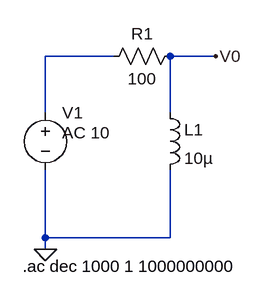
[diagram p0: schematic 1-krets-c.asc]
1-krets-c.asc, the LTspice schematic file:
Version 4
SHEET 1 880 680
WIRE 64 48 -32 48
WIRE 208 48 144 48
WIRE -32 128 -32 48
WIRE 144 128 144 48
WIRE -32 304 -32 208
WIRE 144 304 144 208
WIRE 144 304 -32 304
WIRE -32 320 -32 304
FLAG -32 320 0
FLAG 208 48 V0
SYMBOL voltage -32 112 R0
WINDOW 123 24 44 Left 0
WINDOW 39 0 0 Left 0
SYMATTR Value2 AC 10
SYMATTR InstName V1
SYMATTR Value ""
SYMBOL res 160 32 R90
WINDOW 0 0 56 VBottom 0
WINDOW 3 32 56 VTop 0
SYMATTR InstName R1
SYMATTR Value 100
SYMBOL ind 128 112 R0
SYMATTR InstName L1
SYMATTR Value 10µ
SYMATTR SpiceLine Cpar=0
TEXT -64 344 Left 0 !.ac dec 1000 1 1000000000

The netlist it stands for:
* 1-krets-c.asc
V1 N001 0 AC 10
R1 V0 N001 100
L1 V0 0 10µ Cpar=0
.ac dec 1000 1 1000000000
.backanno
.end